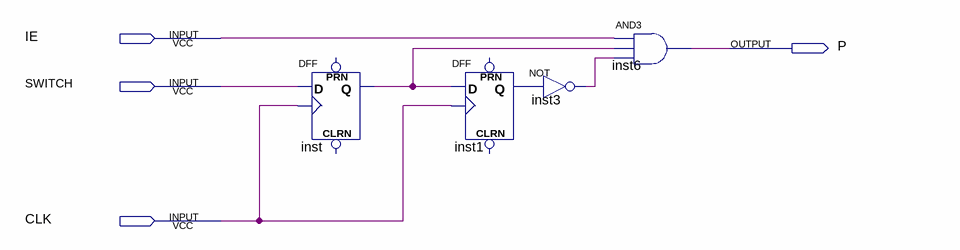
[diagram p0: schematic sheet]
// Quartus schematic pulse_generator.bdf as structural Verilog: 4 symbols, 4 pins
module pulse_generator (
  input  IE,
  input  SWITCH,
  input  CLK,
  output P
);

  wire inst1_q, inst3_out, inst_q;

  DFF inst (.CLK(CLK), .D(SWITCH), .Q(inst_q));  // open: CLRN, PRN
  DFF inst1 (.CLK(CLK), .D(inst_q), .Q(inst1_q));  // open: CLRN, PRN
  not inst3 (inst3_out, inst1_q);
  and inst6 (P, IE, inst_q, inst3_out);
endmodule
